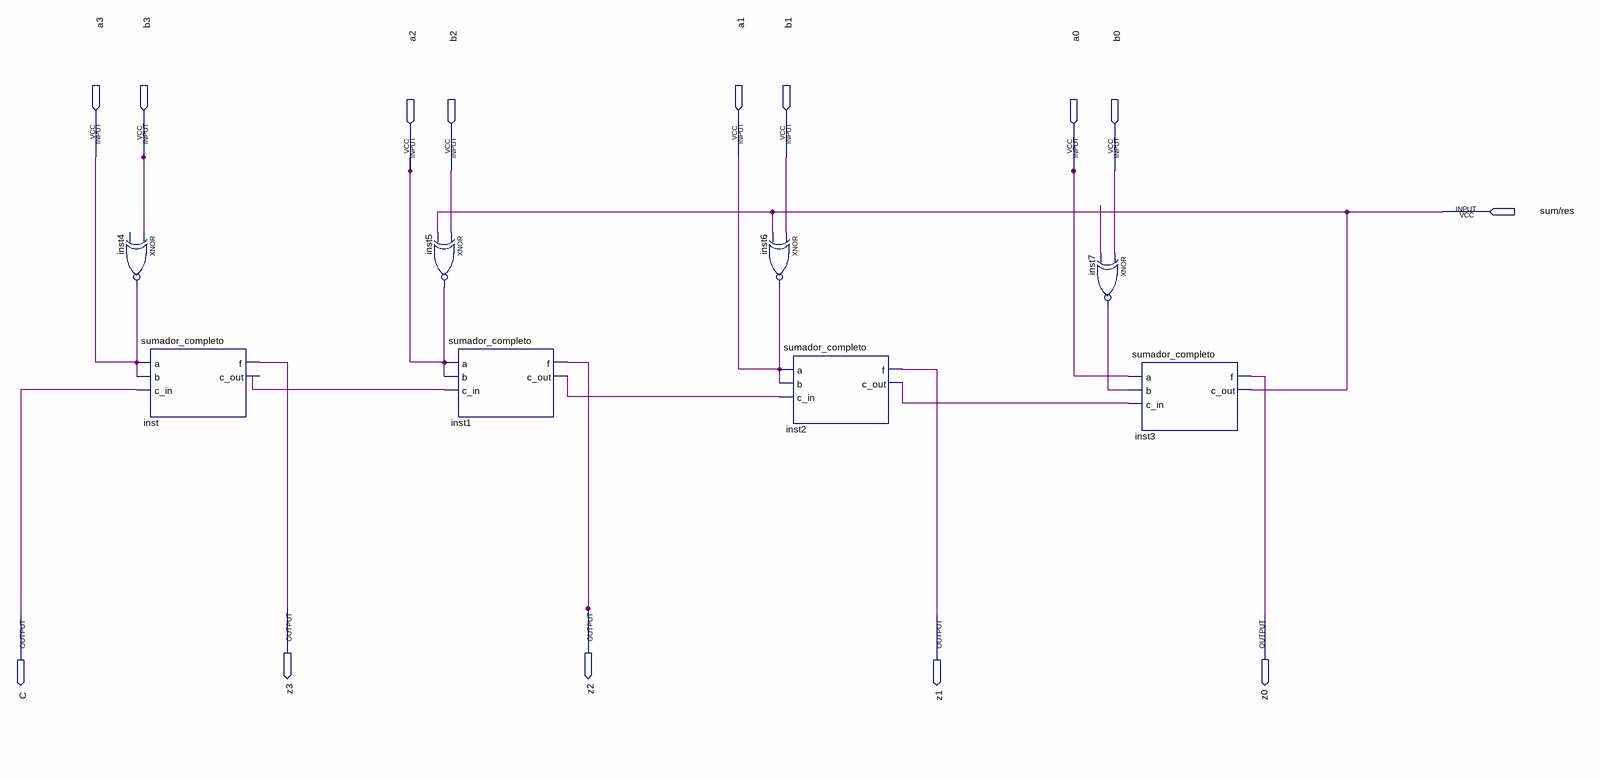
[diagram p0: schematic sheet]
// Quartus schematic Sumador_Restador.bdf as structural Verilog: 8 symbols, 14 pins
module Sumador_Restador (
  input  a3,
  input  b3,
  input  a1,
  input  b1,
  input  a2,
  input  b2,
  input  a0,
  input  b0,
  input  \sum/res ,
  output z3,
  output z2,
  output C,
  output z1,
  output z0
);

  wire inst1_c_out, inst2_c_out, inst7_out, undriven, undriven_2;

  not inst4 (a3, b3);  // XNOR open: IN2
  sumador_completo inst (.a(a3), .b(a3), .c_in(C), .f(z3));  // open: c_out
  xnor inst5 (a2, b2, \sum/res );
  sumador_completo inst1 (.a(a2), .b(a2), .c_in(undriven_2), .f(z2), .c_out(inst1_c_out));
  xnor inst6 (a1, b1, \sum/res );
  sumador_completo inst2 (.a(a1), .b(a1), .c_in(inst1_c_out), .f(z1), .c_out(inst2_c_out));
  xnor inst7 (inst7_out, b0, undriven);
  sumador_completo inst3 (.a(a0), .b(inst7_out), .c_in(inst2_c_out), .f(z0), .c_out(\sum/res ));
endmodule
